# EAGLE design untitled (EAGLE 8.2.2)
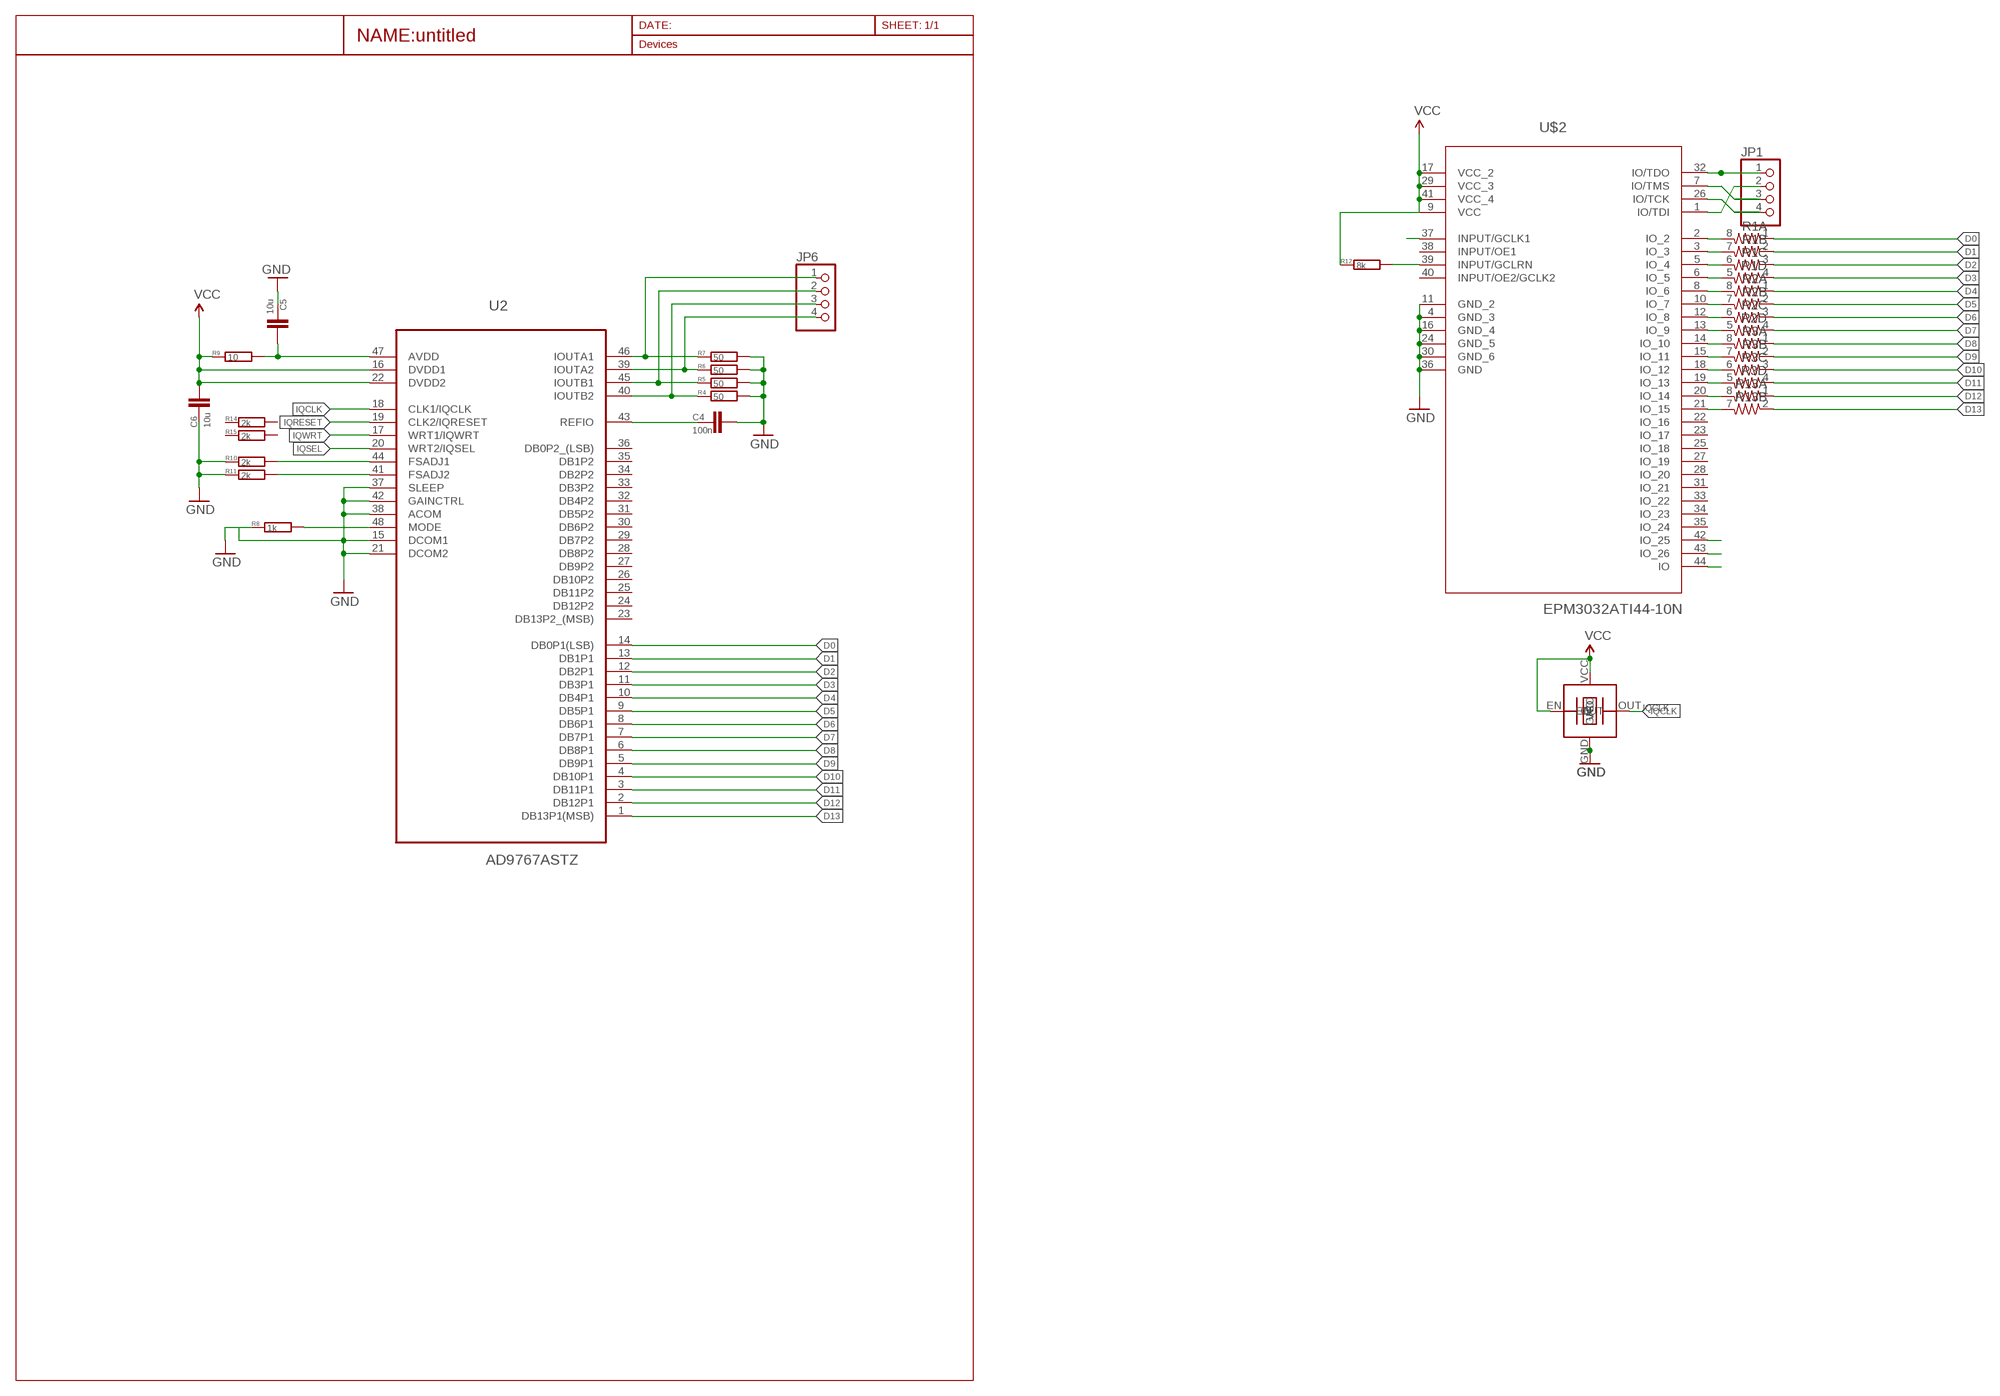
[diagram p0: schematic, sheet 1]

## Parts
C4  100n  CC0805  [C0805]
C5  10u  CC0805  [C0805]
C6  10u  CC0805  [C0805]
JP1  PINHD-1X4  [1X04]
JP6  PINHD-1X4  [1X04]
R1  RESISTOR-ARRAY0603-ARV  [0603-ARV]
R2  RESISTOR-ARRAY0603-ARV  [0603-ARV]
R3  RESISTOR-ARRAY0603-ARV  [0603-ARV]
R4  50  R0805  [R0805]
R5  50  R0805  [R0805]
R6  50  R0805  [R0805]
R7  50  R0805  [R0805]
R8  1k  R0805  [R0805]
R9  10  R0805  [R0805]
R10  2k  R0805  [R0805]
R11  2k  R0805  [R0805]
R12  8k  R0805  [R0805]
R13  RESISTOR-ARRAY0603-ARV  [0603-ARV]
R14  2k  R0805  [R0805]
R15  2k  R0805  [R0805]
U2  AD9767ASTZ  [QFP50P900X900X160-48N]
U$2  EPM3032ATI44-10N  [QFP80P1200X1200X120-44N]
U$3  TXC-BA  [7X5]

## Nets
!OUT1: JP6.2 R5.1 U2.45(IOUTB1)
!OUT2: JP6.4 R6.1 U2.39(IOUTA2)
D0: R1.1 U2.14(DB0P1(LSB))
D1: R1.2 U2.13(DB1P1)
D2: R1.3 U2.12(DB2P1)
D3: R1.4 U2.11(DB3P1)
D4: R2.1 U2.10(DB4P1)
D5: R2.2 U2.9(DB5P1)
D6: R2.3 U2.8(DB6P1)
D7: R2.4 U2.7(DB7P1)
D8: R3.1 U2.6(DB8P1)
D9: R3.2 U2.5(DB9P1)
D10: R3.3 U2.4(DB10P1)
D11: R3.4 U2.3(DB11P1)
D12: R13.1 U2.2(DB12P1)
D13: R13.2 U2.1(DB13P1(MSB))
GND: C4.1 C5.2 C6.2 R4.2 R5.2 R6.2 R7.2 R8.1 R10.1 R11.1 U2.15(DCOM1) U2.21(DCOM2) U2.37(SLEEP) U2.38(ACOM) U2.42(GAINCTRL) U$2.4(GND_3) U$2.11(GND_2) U$2.16(GND_4) U$2.24(GND_5) U$2.30(GND_6) U$2.36(GND) U$3.GND
IQCLK: U2.18(CLK1/IQCLK) U$2.37(INPUT/GCLK1) U$3.OUT
IQRESET: U2.19(CLK2/IQRESET) U$2.43(IO_26)
IQSEL: U2.20(WRT2/IQSEL) U$2.42(IO_25)
IQWRT: U2.17(WRT1/IQWRT) U$2.44(IO)
N$1: C5.1 R9.2 U2.47(AVDD)
N$2: R8.2 U2.48(MODE)
N$4: R12.2 U$2.39(INPUT/GCLRN)
N$5: R10.2 U2.44(FSADJ1)
N$6: JP1.1 U$2.32(IO/TDO)
N$9: JP1.3 U$2.7(IO/TMS)
N$10: JP1.2 U$2.1(IO/TDI)
N$11: JP1.4 U$2.26(IO/TCK)
N$22: R11.2 U2.41(FSADJ2)
N$23: R1.8 U$2.2(IO_2)
N$24: R1.7 U$2.3(IO_3)
N$25: C4.2 U2.43(REFIO)
N$28: R1.6 U$2.5(IO_4)
N$29: R1.5 U$2.6(IO_5)
N$30: R2.8 U$2.8(IO_6)
N$31: R2.7 U$2.10(IO_7)
N$32: R2.6 U$2.12(IO_8)
N$33: R2.5 U$2.13(IO_9)
N$34: R3.8 U$2.14(IO_10)
N$35: R3.7 U$2.15(IO_11)
N$36: R3.6 U$2.18(IO_12)
N$37: R3.5 U$2.19(IO_13)
N$38: R13.8 U$2.20(IO_14)
N$39: R13.7 U$2.21(IO_15)
OUT1: JP6.1 R7.1 U2.46(IOUTA1)
OUT2: JP6.3 R4.1 U2.40(IOUTB2)
VCC: C6.1 R9.1 R12.1 U2.16(DVDD1) U2.22(DVDD2) U$2.9(VCC) U$2.17(VCC_2) U$2.29(VCC_3) U$2.41(VCC_4) U$3.EN U$3.VCC
Unconnected: R13.3 R13.4 R13.5 R13.6 R14.1 R14.2 R15.1 R15.2 U2.23(DB13P2_(MSB)) U2.24(DB12P2) U2.25(DB11P2) U2.26(DB10P2) U2.27(DB9P2) U2.28(DB8P2) U2.29(DB7P2) U2.30(DB6P2) U2.31(DB5P2) U2.32(DB4P2) U2.33(DB3P2) U2.34(DB2P2) U2.35(DB1P2) U2.36(DB0P2_(LSB)) U$2.22(IO_16) U$2.23(IO_17) U$2.25(IO_18) U$2.27(IO_19) U$2.28(IO_20) U$2.31(IO_21) U$2.33(IO_22) U$2.34(IO_23) U$2.35(IO_24) U$2.38(INPUT/OE1) U$2.40(INPUT/OE2/GCLK2)

## Library data of the parts
C4-C6 = smalsmd:C: Capacitor
JP1 JP6 = pinhead:PINHD-1X4: PIN HEADER
R1-R3 R13 = SparkFun-Passives:RESISTOR-ARRAY: Array Chip Resistor Source: RS Component / Phycomp
R4-R12 R14 R15 = smalsmd:R
U2 = Analog Devices_By_element14_Batch_1:AD9767ASTZ: Digital-to-Analog Converter; MPN: AD9767ASTZ; OC_FARNELL: -; OC_NEWARK: 59K7411; PACKAGE: QFP-48; SUPPLIER: ANALOG DEVICES
U$2 = Altera_By_element14_Batch_1:EPM3032ATI44-10N: Programmable Logic Device; MPN: EPM3032ATI44-10N; OC_FARNELL: 1549416; OC_NEWARK: 51R9376; PACKAGE: 44-TQFP; SUPPLIER: Altera
U$3 = txc:TXC-BA**

## Board
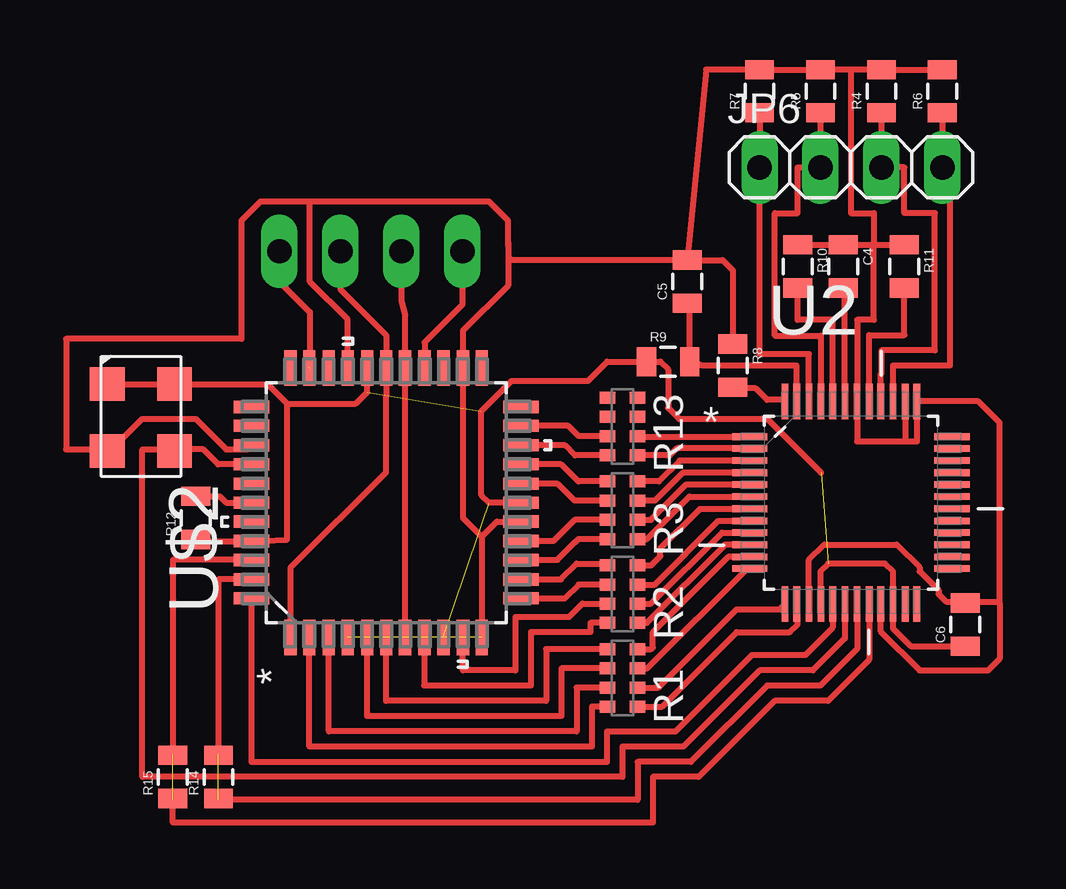
[diagram p1: board, top side]
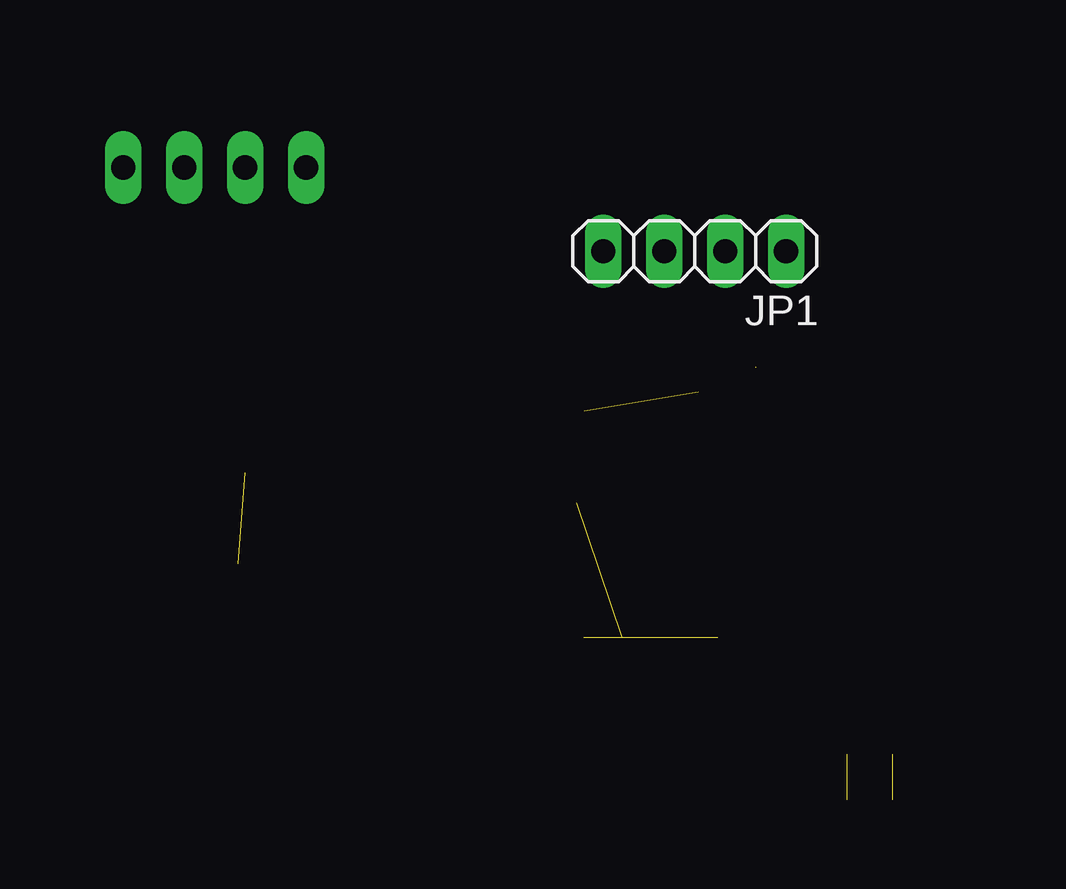
[diagram p2: board, bottom side, seen from below]

No outline drawn. Coordinates in mm, seen from the top.
Copper layers (1*16): Top 0.035mm / dielectric 1.5mm / Bottom 0.035mm
Design rules "my": minimum track width 0.2mm, minimum drill 0.2mm, track to track 0.2mm, track to pad 0.2mm, pad to pad 0.2mm, via to via 0.2mm, smd to smd 0.2mm, copper to edge 0.2mm, drill to drill 1mm, minimum pad ring 10mil, minimum via ring 8mil, stop-mask expansion 4mil, vias tented up to drill 0mil, thermal gap 10mil

### Footprints (pad centres in the part's own frame; a part is rotated, then mirrored left to right if it is on the bottom)
C0805 = smd 0.8 x 1.2: 1 -0.9,0; 2 0.9,0
1X04 = drill 1.016 long: 1 -3.81,0; 2 -1.27,0; 3 1.27,0; 4 3.81,0
0603-ARV = smd 0.5 x 0.65: 1 -1.2,-0.625; 2 -0.4,-0.625; 3 0.4,-0.625; 4 1.2,-0.625; 5 1.2,0.625; 6 0.4,0.625; 7 -0.4,0.625; 8 -1.2,0.625
R0805 = smd 0.8 x 1.2: 1 -0.9,0; 2 0.9,0
QFP50P900X900X160-48N = smd 1.473 x 0.279: 1 -4.216,2.743; 2 -4.216,2.261; 3 -4.216,1.753; 4 -4.216,1.245; 5 -4.216,0.762; 6 -4.216,0.254; 7 -4.216,-0.254; 8 -4.216,-0.762; 9 -4.216,-1.245; 10 -4.216,-1.753; 11 -4.216,-2.261; 12 -4.216,-2.743; 25 4.216,-2.743; 26 4.216,-2.261; 27 4.216,-1.753; 28 4.216,-1.245; 29 4.216,-0.762; 30 4.216,-0.254; 31 4.216,0.254; 32 4.216,0.762; 33 4.216,1.245; 34 4.216,1.753; 35 4.216,2.261; 36 4.216,2.743 | smd 0.279 x 1.473: 13 -2.743,-4.216; 14 -2.261,-4.216; 15 -1.753,-4.216; 16 -1.245,-4.216; 17 -0.762,-4.216; 18 -0.254,-4.216; 19 0.254,-4.216; 20 0.762,-4.216; 21 1.245,-4.216; 22 1.753,-4.216; 23 2.261,-4.216; 24 2.743,-4.216; 37 2.743,4.216; 38 2.261,4.216; 39 1.753,4.216; 40 1.245,4.216; 41 0.762,4.216; 42 0.254,4.216; 43 -0.254,4.216; 44 -0.762,4.216; 45 -1.245,4.216; 46 -1.753,4.216; 47 -2.261,4.216; 48 -2.743,4.216
QFP80P1200X1200X120-44N = smd 1.473 x 0.508: 1 -5.613,3.988; 2 -5.613,3.2; 3 -5.613,2.388; 4 -5.613,1.6; 5 -5.613,0.787; 6 -5.613,0; 7 -5.613,-0.787; 8 -5.613,-1.6; 9 -5.613,-2.388; 10 -5.613,-3.2; 11 -5.613,-3.988; 23 5.613,-3.988; 24 5.613,-3.2; 25 5.613,-2.388; 26 5.613,-1.6; 27 5.613,-0.787; 28 5.613,0; 29 5.613,0.787; 30 5.613,1.6; 31 5.613,2.388; 32 5.613,3.2; 33 5.613,3.988 | smd 0.508 x 1.473: 12 -3.988,-5.613; 13 -3.2,-5.613; 14 -2.388,-5.613; 15 -1.6,-5.613; 16 -0.787,-5.613; 17 0,-5.613; 18 0.787,-5.613; 19 1.6,-5.613; 20 2.388,-5.613; 21 3.2,-5.613; 22 3.988,-5.613; 34 3.988,5.613; 35 3.2,5.613; 36 2.388,5.613; 37 1.6,5.613; 38 0.787,5.613; 39 0,5.613; 40 -0.787,5.613; 41 -1.6,5.613; 42 -2.388,5.613; 43 -3.2,5.613; 44 -3.988,5.613
7X5 = smd 1.4 x 1.45: EN -1.448,-1.465; GND 1.333,-1.465; OUT 1.333,1.345; VCC -1.448,1.345

### Placement (x,y rotation side)
C4  32.38,32.07 270 top
C5  25.88,31.43 90 top
C6  37.47,17.14 90 top
JP1  12.7,32.7 180 bottom
JP6  32.7,36.2 0 top
R1  23.18,14.92 90 top
R2  23.18,18.41 90 top
R3  23.18,21.91 90 top
R4  33.97,39.37 90 top
R5  31.43,39.37 90 top
R6  36.51,39.37 90 top
R7  28.89,39.37 90 top
R8  27.78,27.94 270 top
R9  25.08,28.1 0 top
R10  30.48,32.07 270 top
R11  34.92,32.07 270 top
R12  5.4,21.59 90 top
R13  23.18,25.4 90 top
R14  6.35,10.79 90 top
R15  4.45,10.79 90 top
U2  32.7,22.23 0 top
U$2  13.34,22.23 90 top
U$3  TXC-BA*  [7X5]  3.17,25.72 270 top

### Tracks (layer width: path | path; a pad name or v marks a point on that pad's centre or on a via)
!OUT1
  Top 0.254: U2.45 31.46,29.18 29.53,29.18 29.53,34.29 30.48,34.29 30.48,36.2 JP6.2 R5.1
!OUT2
  Top 0.254: U2.39 34.45,27.94 36.83,27.94 36.83,37.47 JP6.4 R6.1
D0
  Top 0.254: R1.1 24.84,13.72 27.94,16.83 30.16,16.83 30.48,17.14 30.48,17.97 U2.14
D1
  Top 0.254: R1.2 24.68,14.52 27.94,17.78 29.73,17.78 U2.13
D2
  Top 0.254: U2.12 28.37,19.48 24.21,15.32 R1.3
D3
  Top 0.254: U2.11 27.58,19.96 24.45,16.83 24.45,16.19 24.38,16.12 R1.4
D4
  Top 0.254: R2.1 24.2,17.21 27.46,20.47 U2.10
D5
  Top 0.254: U2.9 27.33,20.98 24.36,18.02 R2.2
D6
  Top 0.254: U2.8 27.18,21.46 24.53,18.82 R2.3
D7
  Top 0.254: U2.7 26.42,21.97 24.77,20.32 24.77,20 24.38,19.61 R2.4
D8
  Top 0.254: U2.6 25.97,22.48 24.2,20.71 R3.1
D9
  Top 0.254: U2.5 25.84,22.99 24.36,21.51 R3.2
D10
  Top 0.254: R3.3 24.53,22.31 25.69,23.47 U2.4
D11
  Top 0.254: U2.3 25.57,23.98 24.7,23.11 R3.4
D12
  Top 0.254: U2.2 25.44,24.49 25.15,24.2 R13.1
D13
  Top 0.254: R13.2 23.83,24.97 U2.1
GND  (1 unrouted)
  Top 0.254: R10.1 C4.1 33.66,32.97 | 33.66,32.97 R11.1 | 33.66,32.97 33.66,29.84 32.96,29.84 U2.42 32.96,24.77 34.96,24.77 | R6.2 R4.2 32.7,40.27 | 32.7,40.27 R5.2 R7.2 26.67,40.27 C5.2 | 32.7,40.27 32.7,34.29 33.66,34.29 33.66,32.97 | 7.72,24.67 U$2.36 7.56,24.45 6.67,24.45 5.4,25.72 3.17,25.72 1.84,24.39 U$3.GND 1.65,24.45 0,24.45 0,29.05 7.3,29.05 7.3,33.97 8.1,34.77 10.16,34.77 | 17.32,20.82 U$2.11 | U$2.16 17.95,21.44 17.32,20.82 | 17.32,20.82 16.54,21.6 U$2.24 16.54,29.39 18.41,31.27 18.41,33.07 | U$2.30 11.73,29.86 10.16,31.43 10.16,34.77 | 18.41,33.07 18.41,33.97 17.62,34.77 10.16,34.77 | C5.2 18.48,32.33 18.41,33.07 | 38.89,18.04 38.89,25.56 38.01,26.44 U2.37 35.45,24.77 34.96,24.77 | 38.89,18.04 38.89,15.72 38.42,15.24 35.56,15.24 33.95,16.85 U2.21 | 38.89,18.04 38.84,18.1 37.49,18.1 37.47,18.12 C6.2 37.41,18.1 36.67,18.1 36.35,18.41 36.35,18.57 35.56,19.37 35.56,19.53 34.61,20.48 31.59,20.48 30.95,19.84 U2.15 | U2.38 34.96,24.77 | C5.2 27.36,32.33 27.78,31.91 R8.1
IQCLK
  Top 0.254: U$2.37 6.34,23.82 5.71,24.45 4.58,24.45 U$3.OUT 4.52,24.45 3.17,24.45 3.17,10.79 23.18,10.79 23.18,12.06 25.72,12.06 28.89,15.24 31.11,15.24 32.45,16.57 U2.18
IQRESET  (1 unrouted)
  Top 0.254: U2.19 32.96,16.13 31.43,14.61 29.21,14.61 26.04,11.43 23.81,11.43 23.81,9.84 6.35,9.84 | U$2.43 6.35,19.02 6.35,11.75
IQSEL  (1 unrouted)
  Top 0.254: U2.20 33.47,15.68 31.75,13.97 29.53,13.97 26.35,10.79 24.45,10.79 24.45,8.89 4.45,8.89 4.45,9.84 | U$2.42 4.45,19.84 4.45,11.75
IQWRT
  Top 0.254: U$2.44 7.72,11.43 22.54,11.43 22.54,12.7 25.4,12.7 28.57,15.88 30.8,15.88 31.94,17.02 U2.17
N$1
  Top 0.254: U2.47 30.44,27.94 26.51,27.94 R9.2 25.98,30.43 C5.1
N$2
  Top 0.254: U2.48 29.89,26.51 29.21,26.51 28.73,26.99 27.83,26.99 R8.2
N$4
  Top 0.254: R12.2 6.4,22.49 6.67,22.23 U$2.39 | U$2.39
N$5
  Top 0.254: U2.44 31.94,29.84 30.48,29.84 R10.2
N$6  (1 unrouted)
  Top 0.254: JP1.1 8.89,31.43 10.16,30.16 10.16,27.86
N$9
  Top 0.254: U$2.7 14.12,24.93 14.13,25.72 14.13,30 13.97,30.64 JP1.3
N$10
  Top 0.254: JP1.2 11.43,31.11 13.34,29.21 13.34,26.67 13.34,23.5 9.35,19.51 U$2.1
N$11
  Top 0.254: 14.92,27.85 U$2.26 14.94,28.91 16.51,30.48 JP1.4
N$22
  Top 0.254: U2.41 33.47,29.21 34.92,29.21 R11.2
N$23
  Top 0.254: R1.8 21.91,13.72 21.91,12.06 10.13,12.06 U$2.2
N$24
  Top 0.254: R1.7 21.27,14.52 21.27,12.7 10.95,12.7 U$2.3
N$25
  Top 0.254: U2.43 32.45,31.11 32.38,31.11 C4.2
N$28
  Top 0.254: R1.6 20.64,15.32 20.64,13.34 12.55,13.34 U$2.5
N$29
  Top 0.254: R1.5 20,16.12 20,13.97 13.34,13.97 U$2.6
N$30
  Top 0.254: U$2.8 14.94,14.62 14.92,14.61 19.37,14.61 19.37,16.83 21.85,16.83 21.85,17.21 R2.8
N$31
  Top 0.254: 16.51,16.64 U$2.10 16.54,15.24 18.73,15.24 18.73,17.46 20.95,17.46 21.51,18.02 R2.7
N$32
  Top 0.254: U$2.12 20.78,18.24 21.36,18.82 R2.6
N$33
  Top 0.254: U$2.13 20.61,19.02 21.27,19.68 22.48,19.68 R2.5
N$34
  Top 0.254: U$2.14 20.47,19.84 21.2,20.57 21.27,20.64 21.34,20.71 R3.8
N$35
  Top 0.254: U$2.15 20.31,20.62 21.19,21.51 R3.7
N$36
  Top 0.254: U$2.18 20.48,23.01 21.19,22.31 R3.6
N$37
  Top 0.254: U$2.19 20.62,23.82 21.34,23.11 R3.5
N$38
  Top 0.254: U$2.20 20.79,24.61 21.2,24.2 R13.8
N$39
  Top 0.254: U$2.21 20.93,25.43 21.36,25 R13.7
OUT1
  Top 0.254: U2.46 30.95,28.42 28.89,28.42 JP6.1 R7.1
OUT2
  Top 0.254: U2.40 33.95,27.6 33.97,27.6 33.97,28.57 36.2,28.57 36.2,34.29 34.92,34.29 34.92,36.2 JP6.3 R4.1
VCC  (3 unrouted)
  Top 0.254: C6.1 35.19,16.25 34.45,16.98 U2.22 34.45,19.36 34.13,19.68 31.75,19.68 31.43,19.37 31.43,18.03 U2.16 | 31.46,23.47 29.21,25.72 25.54,25.72 25.08,26.18 25.08,27.78 24.77,28.1 R9.1 22.54,28.1 21.75,27.3 18.57,27.3 17.3,26.04 17.3,22.54 17.62,22.23 U$2.17 | R12.1 5.46,20.62 U$2.41 9.21,20.68 9.21,26.35 | U$3.EN U$3.VCC 8.39,27.16 9.21,26.35 | 9.21,26.35 12.06,26.35 12.55,26.84 U$2.29